# EAGLE design tes1 (EAGLE 6.6.0)
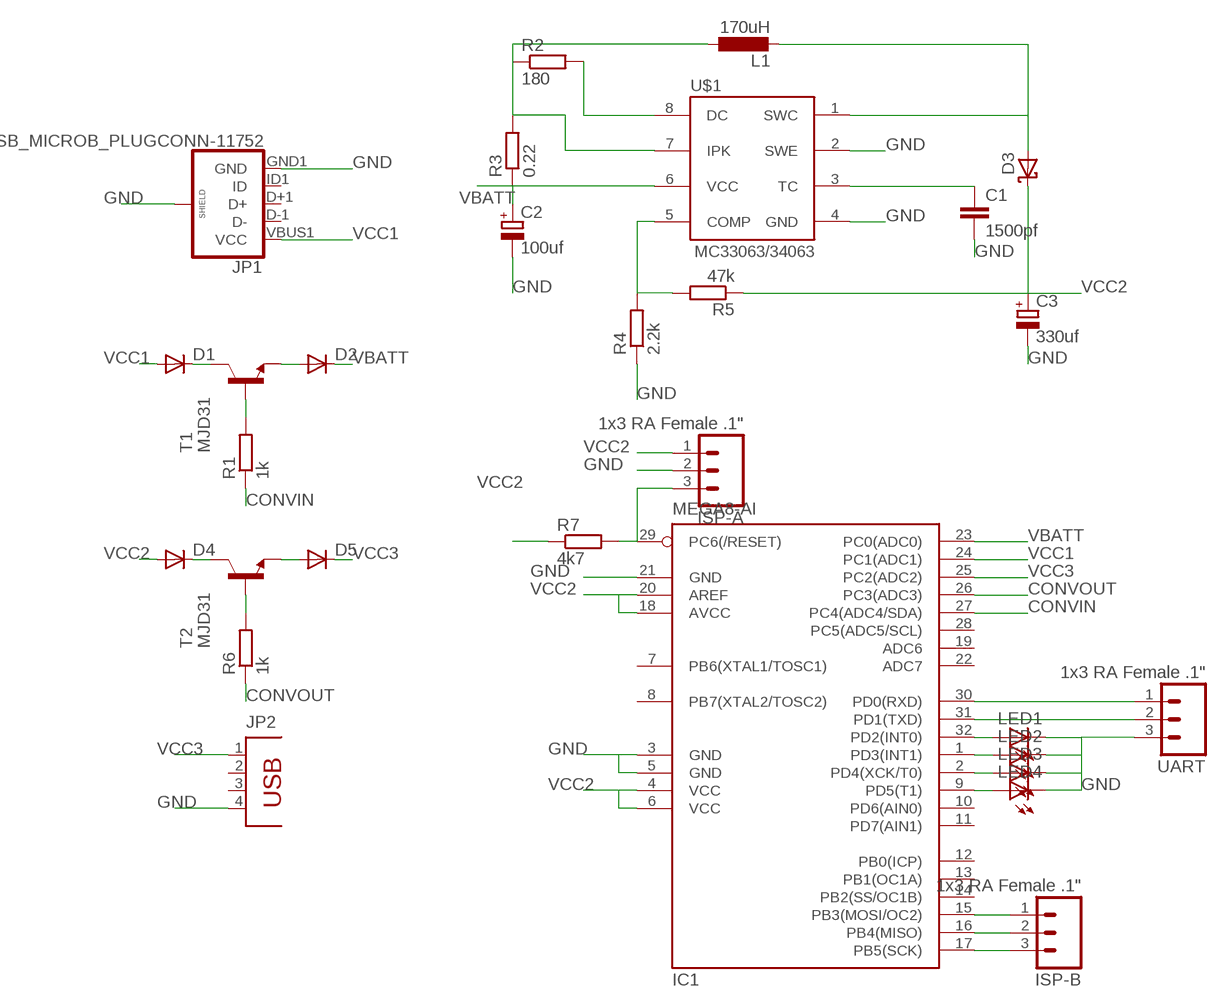
[diagram p0: schematic, sheet 1]

## Parts
C1  1500pf  C-EUC1206  [C1206]
C2  100uf  CPOL-EU153CLV-1014  [153CLV-1014]
C3  330uf  CPOL-EU153CLV-1014  [153CLV-1014]
D1  DIODE-SMC  [SMC]
D2  DIODE-SMC  [SMC]
D3  SCHOTTKY-DIODEF126Z12  [F126Z12]
D4  DIODE-SMC  [SMC]
D5  DIODE-SMC  [SMC]
IC1  MEGA8-AI  [TQFP32-08]
ISP-A  1x3 RA Female .1"  M03SMD_RA_FEMALE  [1X03_SMD_RA_FEMALE]
ISP-B  1x3 RA Female .1"  M03SMD_RA_FEMALE  [1X03_SMD_RA_FEMALE]
JP1  USB_MICROB_PLUGCONN-11752  [USB-B-MICRO-SMD_V03]
JP2  PN87520  [PN87520]
L1  170uH  L-EUL5650M  [L5650M]
LED1  LEDSML1206  [SML1206]
LED2  LEDSML1206  [SML1206]
LED3  LEDSML1206  [SML1206]
LED4  LEDSML1206  [SML1206]
R1  1k  R-EU_R1206  [R1206]
R2  180  R-EU_R1206  [R1206]
R3  0.22  R-EU_R1206  [R1206]
R4  2.2k  R-EU_R1206  [R1206]
R5  47k  R-EU_R1206  [R1206]
R6  1k  R-EU_R1206  [R1206]
R7  4k7  R-EU_R1206  [R1206]
T1  MJD31  [DPAK]
T2  MJD31  [DPAK]
U$1  MC33063/MC34063D  [SO08]
UART  1x3 RA Female .1"  M03SMD_RA_FEMALE  [1X03_SMD_RA_FEMALE]

## Nets
CONVIN: IC1.27(PC4(ADC4/SDA)) R1.1
CONVOUT: IC1.26(PC3(ADC3)) R6.1
GND: C1.2 C2.- C3.- IC1.3(GND) IC1.5(GND) IC1.21(GND) ISP-A.2 JP1.GND1(GND) JP1.SHIELD1(SHIELD) JP1.SHIELD2(SHIELD) JP1.SHIELD3(SHIELD) JP2.4 LED1.C LED2.C LED3.C LED4.C R4.1 U$1.2(SWE) U$1.4(GND) UART.3
N$1: D1.C T1.4(C)
N$2: C1.1 U$1.3(TC)
N$3: D2.A T1.3(E)
N$4: L1.1 R2.1 R3.2 U$1.7(IPK)
N$5: R1.2 T1.1(B)
N$6: R2.2 U$1.8(DC)
N$7: R4.2 R5.2 U$1.5(COMP)
N$8: D4.C T2.4(C)
N$9: D3.A L1.2 U$1.1(SWC)
N$10: D5.A T2.3(E)
N$11: R6.2 T2.1(B)
N$12: IC1.29(PC6(/RESET)) ISP-A.3 R7.2
N$13: IC1.17(PB5(SCK)) ISP-B.3
N$14: IC1.16(PB4(MISO)) ISP-B.2
N$15: IC1.15(PB3(MOSI/OC2)) ISP-B.1
N$16: IC1.9(PD5(T1)) LED4.A
N$17: IC1.2(PD4(XCK/T0)) LED3.A
N$18: IC1.1(PD3(INT1)) LED2.A
N$19: IC1.32(PD2(INT0)) LED1.A
N$20: IC1.31(PD1(TXD)) UART.2
N$21: IC1.30(PD0(RXD)) UART.1
VBATT: C2.+ D2.C IC1.23(PC0(ADC0)) R3.1 U$1.6(VCC)
VCC1: D1.A IC1.24(PC1(ADC1)) JP1.VBUS1(VCC)
VCC2: C3.+ D3.C D4.A IC1.4(VCC) IC1.6(VCC) IC1.18(AVCC) IC1.20(AREF) ISP-A.1 R5.1 R7.1
VCC3: D5.C IC1.25(PC2(ADC2)) JP2.1
Unconnected: IC1.7(PB6(XTAL1/TOSC1)) IC1.8(PB7(XTAL2/TOSC2)) IC1.10(PD6(AIN0)) IC1.11(PD7(AIN1)) IC1.12(PB0(ICP)) IC1.13(PB1(OC1A)) IC1.14(PB2(SS/OC1B)) IC1.19(ADC6) IC1.22(ADC7) IC1.28(PC5(ADC5/SCL)) JP1.D+1(D+) JP1.D-1(D-) JP1.ID1(ID) JP2.2 JP2.3

## Library data of the parts
C1 = resistor:C-EU: CAPACITOR, European symbol
C2 C3 = resistor:CPOL-EU: POLARIZED CAPACITOR, European symbol
D1 D2 D4 D5 = diode:DIODE-: DIODE
D3 = adafruit:SCHOTTKY-DIODE: Schottky Diode
IC1 = atmel:MEGA8: MICROCONTROLLER 8 Kbytes FLASH, 1 kbytes SRAM, 512 bytes EEPROM, USART, 6-channel 10 bit ADC, 2-channel 8 bit ADC Pin compatible with Atmega48, ATMega88, ATMega168 Source: avr.lbr; MPN: ATMEGA8-16AU; OC_FARNELL: 9171371; OC_NEWARK: 73M8863
ISP-A ISP-B UART = SparkFun-Connectors:M03: Header 3 Standard 3-pin 0.1" header. Use with straight break away headers (SKU : PRT-00116), right angle break away headers (PRT-00553), swiss pins (PRT-00743), machine pins (PRT-00117), and female headers (PRT-00115). Molex polarized connector foot print use with SKU : PRT-08232 with associated crimp pins and housings.; PROD_ID: CONN-10926
JP1 = SparkFun-Connectors:USB_MICROB_PLUG: USB Micro-B connectors Some male, some female. Watch your step!; PROD_ID: CONN-11752
JP2 = con-berg:PN87520: BERG USB connector; OC_FARNELL: unknown; OC_NEWARK: unknown
L1 = rcl:L-EU: INDUCTOR, European symbol
LED1-LED4 = led:LED: LED OSRAM: - CHIPLED LG R971, LG N971, LY N971, LG Q971, LY Q971, LO R971, LY R971 LH N974, LH R974 LS Q976, LO Q976, LY Q976 LO Q996 - Hyper CHIPLED LW Q18S LB Q993, LB Q99A, LB R99A - SideLED LS A670, LO A670, LY A670, LG A670, LP A670 LB A673, LV A673, LT A673, LW A673 LH A674 LY A675 LS A676, LA A676, LO A676, LY A676, LW A676 LS A679, LY A679, LG A679 - Hyper Micro SIDELED® LS Y876, LA Y876, LO Y876, LY Y876 LT Y87S - SmartLED LW L88C, LW L88S LB L89C, LB L89S, LG L890 LS L89K, LO L89K, LY L89K LS L896, LA L896, LO L896, LY L896 - TOPLED LS T670, LO T670, LY T670, LG T670, LP T670 LSG T670, LSP T670, LSY T670, LOP T670, LYG T670 LG T671, LOG T671, LSG T671 LB T673, LV T673, LT T673, LW T673 LH T674 LS T676, LA T676, LO T676, LY T676, LB T676, LH T676, LSB T676, LW T676 LB T67C, LV T67C, LT T67C, LS T67K, LO T67K, LY T67K, LW E67C LS E67B, LA E67B, LO E67B, LY E67B, LB E67C, LV E67C, LT E67C LW T67C LS T679, LY T679, LG T679 LS T770, LO T770, LY T770, LG T770, LP T770 LB T773, LV T773, LT T773, LW T773 LH T774 LS E675, LA E675, LY E675, LS T675 LS T776, LA T776, LO T776, LY T776, LB T776 LHGB T686 LT T68C, LB T68C - Hyper Mini TOPLED® LB M676 - Mini TOPLED Santana® LG M470 LS M47K, LO M47K, LY M47K Source: http://www.osram.convergy.de LUXEON: - LUMILED® LXK2-PW12-R00, LXK2-PW12-S00, LXK2-PW14-U00, LXK2-PW14-V00 LXK2-PM12-R00, LXK2-PM12-S00, LXK2-PM14-U00 LXK2-PE12-Q00, LXK2-PE12-R00, LXK2-PE12-S00, LXK2-PE14-T00, LXK2-PE14-U00 LXK2-PB12-K00, LXK2-PB12-L00, LXK2-PB12-M00, LXK2-PB14-N00, LXK2-PB14-P00, LXK2-PB14-Q00 LXK2-PR12-L00, LXK2-PR12-M00, LXK2-PR14-Q00, LXK2-PR14-R00 LXK2-PD12-Q00, LXK2-PD12-R00, LXK2-PD12-S00 LXK2-PH12-R00, LXK2-PH12-S00 LXK2-PL12-P00, LXK2-PL12-Q00, LXK2-PL12-R00 Source: www.luxeon.com KINGBRIGHT: KA-3528ASYC Source: www.kingbright.com
R1 R6 R7 = rcl:R-EU_: RESISTOR, European symbol
R2-R5 = resistor:R-EU_: RESISTOR, European symbol
T1 T2 = transistor-neu-to92:MJD31*: Complementary Power Transistors
U$1 = adafruit:MC33063/MC34063: MC33063 and MC34063 Basic DC/DC converter with internal power-NPN transistor, 100KHz, 1.5A peak switch current. 3-40 input/output.

## Board
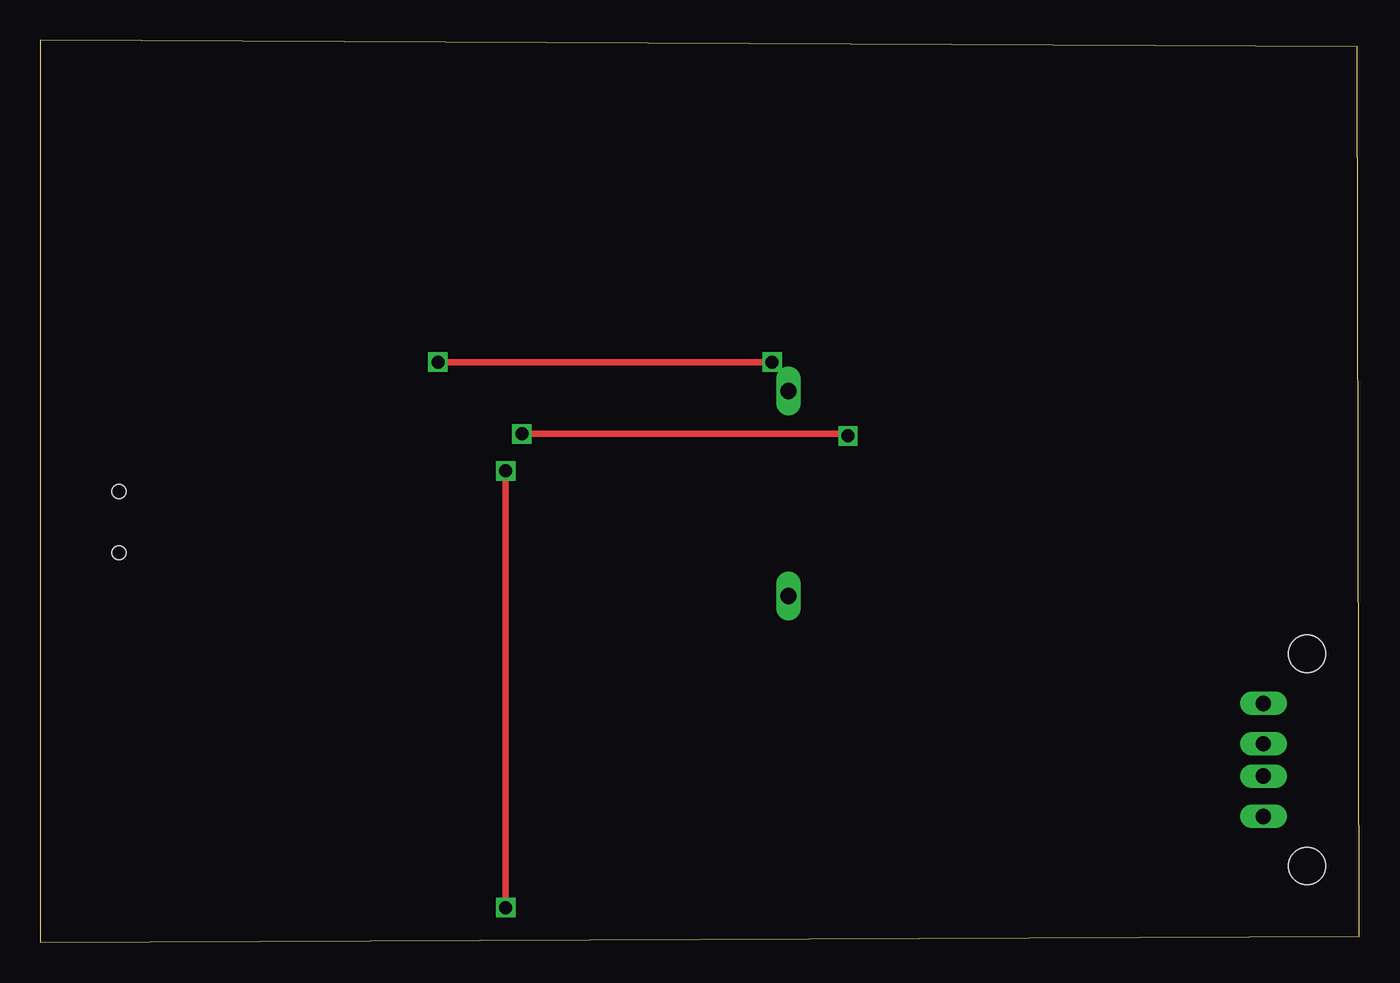
[diagram p1: board, top side]
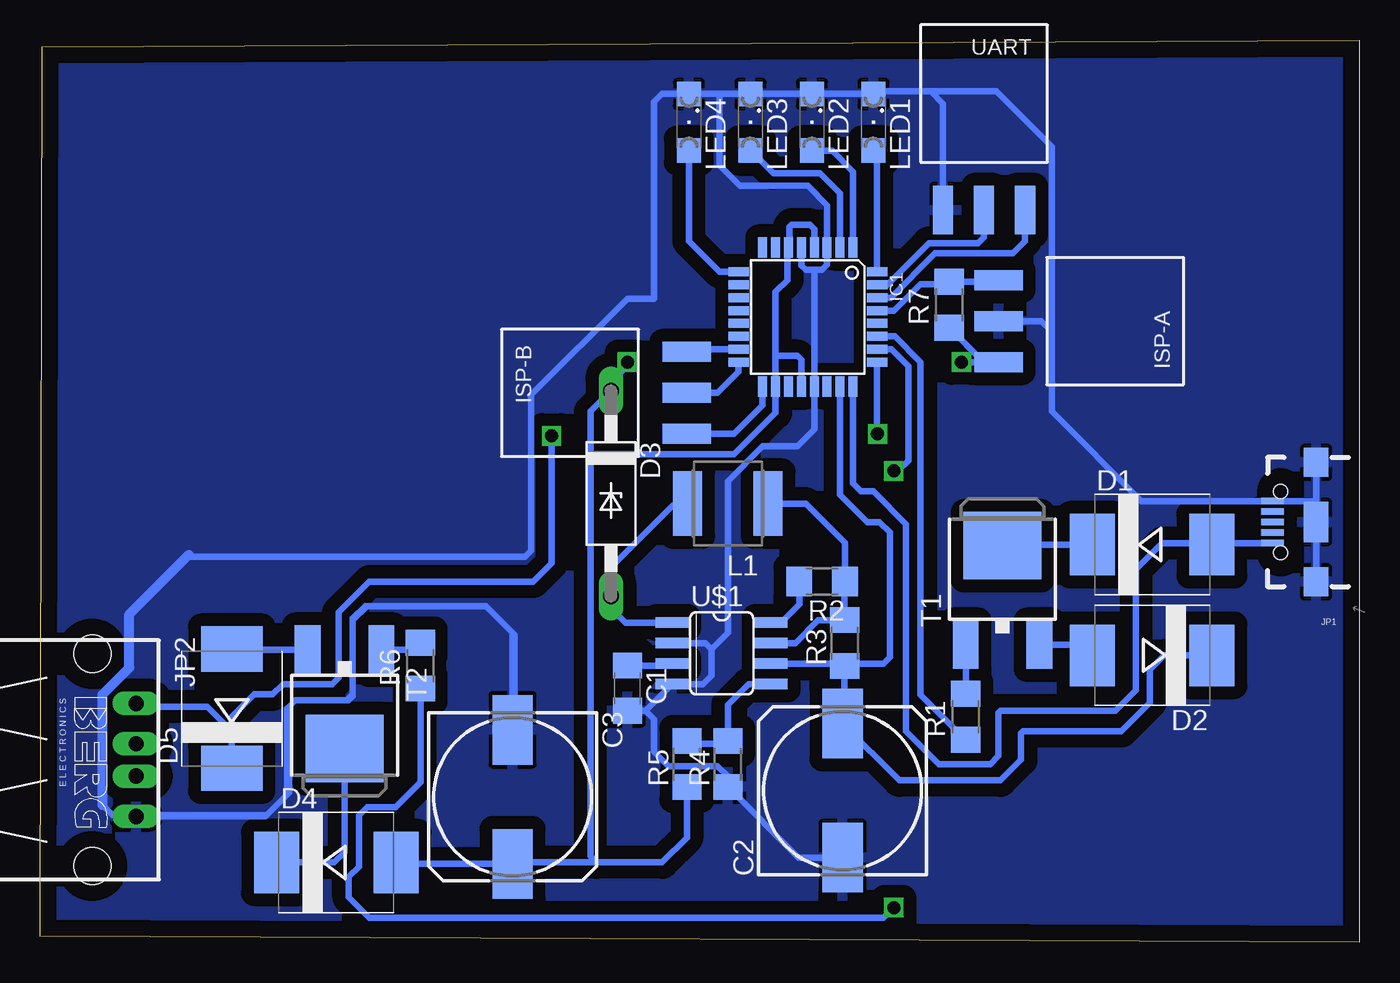
[diagram p2: board, bottom side, seen from below]

Size 81.71 x 55.87 mm. Coordinates in mm from the lower left corner, seen from the top.
Outline: 0,0 81.71,0.38 81.58,55.49 0,55.87 0,0
Copper layers (1*16): Top 0.035mm / dielectric 1.5mm / Bottom 0.035mm
Design rules "default": minimum track width 10mil, minimum drill 24mil, track to track 8mil, track to pad 8mil, pad to pad 8mil, via to via 8mil, smd to smd 8mil, copper to edge 40mil, drill to drill 8mil, minimum pad ring 10mil, minimum via ring 8mil, stop-mask expansion 4mil, vias tented up to drill 0mil, thermal gap 10mil

### Footprints (pad centres in the part's own frame; a part is rotated, then mirrored left to right if it is on the bottom)
C1206 = smd 1.6 x 1.8: 1 -1.4,0; 2 1.4,0
153CLV-1014 = smd 4.3 x 2.5: + 4.15,0; - -4.15,0
SMC = smd 2.8 x 3.8: A 3.7,0; C -3.7,0
F126Z12 = drill 1.016 long: A 6.35,0; C -6.35,0
TQFP32-08 = smd 1.27 x 0.559: 1 -4.293,2.8; 2 -4.293,2; 3 -4.293,1.2; 4 -4.293,0.4; 5 -4.293,-0.4; 6 -4.293,-1.2; 7 -4.293,-2; 8 -4.293,-2.8; 17 4.293,-2.8; 18 4.293,-2; 19 4.293,-1.2; 20 4.293,-0.4; 21 4.293,0.4; 22 4.293,1.2; 23 4.293,2; 24 4.293,2.8 | smd 0.559 x 1.27: 9 -2.8,-4.293; 10 -2,-4.293; 11 -1.2,-4.293; 12 -0.4,-4.293; 13 0.4,-4.293; 14 1.2,-4.293; 15 2,-4.293; 16 2.8,-4.293; 25 2.8,4.293; 26 2,4.293; 27 1.2,4.293; 28 0.4,4.293; 29 -0.4,4.293; 30 -1.2,4.293; 31 -2,4.293; 32 -2.8,4.293
1X03_SMD_RA_FEMALE = smd 1.25 x 3: 1 -2.54,7.225; 2 0,7.225; 3 2.54,7.225
USB-B-MICRO-SMD_V03 = smd 1.4 x 0.4: D+1 2.7,0; D-1 2.7,0.65; GND1 2.7,-1.3; ID1 2.7,-0.65; VBUS1 2.7,1.3 | smd 1.5 x 1.8: SHIELD1 0,3.7; SHIELD2 0,-3.7 | smd 1.5 x 2.5: SHIELD3 0,0 | hole 0.85: 2.2,1.9; 2.2,-1.9
PN87520 = drill 0.95 long: 1 -3.5,2.71; 2 -1,2.71; 3 1,2.71; 4 3.5,2.71 | hole 2.3: -6.57,0; 6.57,0
L5650M = smd 1.8 x 4: 1 -2.5,0; 2 2.5,0
SML1206 = smd 1.5 x 1.5: A 1.75,0; C -1.75,0
R1206 = smd 1.6 x 1.803: 1 -1.422,0; 2 1.422,0
DPAK = smd 1.6 x 3: 1 -2.28,-4.04; 3 2.28,-4.04 | smd 4.826 x 4.191: 4 0,2.096
SO08 = smd 0.66 x 2.032: 1 -1.905,-3.073; 2 -0.635,-3.073; 3 0.635,-3.073; 4 1.905,-3.073; 5 1.905,3.073; 6 0.635,3.073; 7 -0.635,3.073; 8 -1.905,3.073

### Placement (x,y rotation side)
C1  45.34,15.75 270 bottom
C2  32,9.4 90 bottom
C3  52.45,9.02 270 bottom
D1  12.83,24.64 0 bottom
D2  12.83,17.78 180 bottom
D3  46.36,27.81 270 bottom
D4  63.37,4.95 0 bottom
D5  69.85,14.48 90 bottom
IC1  34.16,38.73 270 bottom
ISP-A  15.11,38.48 90 bottom
ISP-B  48.9,34.04 270 bottom
JP1  2.67,26.04 180 bottom
JP2  78.49,11.3 270 bottom
L1  39.12,27.18 180 bottom
LED1  30.1,50.8 270 bottom
LED2  33.91,50.8 270 bottom
LED3  37.72,50.8 270 bottom
LED4  41.53,50.8 270 bottom
R1  24.38,13.97 90 bottom
R2  33.27,22.35 180 bottom
R3  31.88,18.54 90 bottom
R4  39.12,11.05 90 bottom
R5  41.66,11.05 90 bottom
R6  58.17,17.14 90 bottom
R7  25.4,39.5 90 bottom
T1  22.1,22.48 0 bottom
T2  62.87,14.1 180 bottom
U$1  39.5,17.91 270 bottom
UART  23.24,52.58 180 bottom

### Tracks (layer width: path | path; a pad name or v marks a point on that pad's centre or on a via)
CONVIN
  Bottom 0.406: IC1.27 28.77,37.53 27.18,35.94 27.18,15.34 R1.1
CONVOUT  (via drill 0.8)
  Top 0.406: v28.83,29.21 v28.83,2.16
  Bottom 0.406: IC1.26 28.99,36.73 27.94,35.69 27.94,29.85 28.58,29.21 v28.83,29.21 | v28.83,2.16 29.46,1.52 61.34,1.52 62.61,2.79 62.61,4.06 61.98,4.7 61.98,7.87 61.47,8.38 59.69,8.38 58.17,9.91 R6.1
GND
  Bottom 0.406: JP1.SHIELD1 JP1.SHIELD3 2.67,27.34 | 2.67,27.34 JP1.SHIELD2 | 2.67,27.34 JP1.GND1 13.49,27.34 19.05,32.89 19.05,37.85 | C1.2 44.22,14.35 | 44.22,14.35 U$1.4 40.64,16 40.13,16.51 40.13,18.16 | 40.13,18.16 40.51,18.54 U$1.2 | C2.- 34.74,5.25 R4.1 39.12,10.29 39.75,10.92 42.8,10.92 43.69,11.81 43.69,13.81 44.22,14.35 | 39.5,52.55 LED3.C LED2.C LED1.C 29.94,52.7 26.54,52.7 | 39.5,52.55 LED4.C 41.56,52.58 43.18,52.58 43.69,52.07 43.69,39.88 45.34,39.88 51.31,33.91 51.31,24.26 51.69,23.88 72.64,23.88 | 33.91,41.66 33.27,41.66 32.96,41.97 IC1.3 32.96,45.66 34.16,46.86 38.35,46.86 39.62,48.13 39.62,52.42 39.5,52.55 | 33.91,41.66 34.29,41.66 34.54,41.91 34.54,43.01 IC1.5 | 33.91,41.66 33.76,41.51 IC1.21 33.76,31.77 34.8,30.73 36.96,30.73 39.12,28.57 39.12,19.18 40.13,18.16 | ISP-A.2 19.69,38.48 19.05,37.85 | 19.05,37.85 19.05,49.28 22.48,52.7 26.54,52.7 | UART.3 25.78,51.94 26.54,52.7 | JP2.4 67.76,7.8 67.69,7.87 | 67.69,7.87 66.42,9.14 | 66.42,9.14 66.42,14.48 66.29,14.61 | 62.74,14.99 62.61,14.99 62.36,15.24 62.36,19.94 61.47,20.83 | 61.47,20.83 54.1,20.83 52.45,19.18 | 52.45,19.18 52.32,19.05 52.32,13.29 C3.- 52.45,19.18 | 61.47,20.83 61.59,20.83 62.36,20.07 62.36,15.37 62.74,14.99 | 62.74,14.99 65.91,14.99 66.29,14.61 | 66.29,14.61 66.29,9.27 66.42,9.14 | 67.69,7.87 77.22,7.87 77.85,8.51
  Bottom 0.61: 77.85,8.51 77.85,15.37 76.2,17.02 76.2,20.32 72.52,24
  pour Bottom (isolate 0.813): 0.64,55.12 81.03,55.12 81.03,0 0.64,0
N$1
  Bottom 0.406: D1.C 21.46,24.64 21.46,24.38 22.1,24.38 T1.4
N$2
  Bottom 0.406: C1.1 42.69,17.15 U$1.3
N$3
  Bottom 0.406: T1.3 16.53,18.44 D2.A
N$4
  Bottom 0.406: U$1.7 34.93,18.54 33.53,19.94 31.9,19.94 R3.2 31.88,22.33 R2.1 31.85,24.74 34.29,27.18 L1.1
N$5
  Bottom 0.406: R1.2 T1.1
N$6
  Bottom 0.406: U$1.8 35.81,19.81 34.67,20.96 34.67,21.59 34.54,21.72 34.54,22.2 R2.2
N$7
  Bottom 0.406: R5.2 41.5,12.32 38.99,12.32 39.12,12.45 R4.2 39.12,14.73 37.85,16 U$1.5
N$8
  Bottom 0.406: D4.C 63.5,4.95 62.87,5.59 T2.4
N$9
  Bottom 0.406: U$1.1 45.47,19.81 46.36,20.7 D3.A 46.36,23.24 42.55,27.05 41.74,27.05 L1.2
N$10
  Bottom 0.406: T2.3 69.81,18.14 D5.A
N$11
  Bottom 0.406: T2.1 58.6,18.14 R6.2
N$12
  Bottom 0.406: ISP-A.3 22.44,40.92 R7.2 25.55,40.77 27.18,40.77 28.81,39.13 IC1.29
N$13
  Bottom 0.406: IC1.17 36.96,33.27 38.73,31.5 ISP-B.3
N$14
  Bottom 0.406: IC1.16 38.46,35.33 39.75,34.04 ISP-B.2
N$15
  Bottom 0.406: IC1.15 41.51,36.73 ISP-B.1
N$16
  Bottom 0.406: IC1.9 39.63,41.53 41.53,43.43 LED4.A
N$17
  Bottom 0.406: IC1.2 32.16,46.39 33.4,47.62 36.29,47.62 LED3.A
N$18
  Bottom 0.406: IC1.1 31.36,47.75 32.64,49.02 33.88,49.02 LED2.A
N$19
  Bottom 0.406: IC1.32 29.87,48.82 LED1.A
N$20
  Bottom 0.406: IC1.31 29.24,40.73 26.67,43.31 23.62,43.31 23.24,43.69 UART.2
N$21
  Bottom 0.406: IC1.30 29.03,39.93 26.29,42.67 21.46,42.67 20.7,43.43 UART.1
VBATT
  Bottom 0.406: R3.1 31.88,13.55 C2.+ 28.49,10.03 22.23,10.03 20.95,11.3 20.95,12.95 20.83,13.08 14.73,13.08 12.95,14.86 12.95,16.89 12.06,17.78 D2.C | U$1.6 31.88,17.27 R3.1 | IC1.23 32.16,27.72 30.48,26.04 29.72,26.04 29.08,25.4 29.08,17.65 29.46,17.27 31.73,17.27 R3.1
VCC1
  Bottom 0.406: JP1.VBUS1 9.13,24.73 | 9.13,24.73 D1.A | 9.13,24.73 12.22,24.73 13.84,23.11 13.84,15.62 15.11,14.35 22.23,14.35 22.35,14.22 22.35,11.56 22.86,11.05 26.03,11.05 28.07,13.08 28.07,25.91 30.1,27.94 30.86,27.94 31.37,28.45 31.36,28.45 IC1.24
VCC2  (via drill 0.8)
  Top 0.406: v24.64,35.94 v45.34,35.94
  Bottom 0.406: D4.A 59.93,4.7 60.2,4.7 60.03,4.87 C3.+ 52.37,4.95 47.24,4.95 | R5.1 41.66,6.48 43.18,4.95 47.24,4.95 | ISP-A.1 23.24,35.94 | 23.24,35.94 23.27,35.94 | 23.27,35.94 R7.1 25.38,38.07 23.24,35.94 | IC1.4 33.76,44.18 34.04,44.45 35.18,44.45 35.31,44.32 35.31,43.08 IC1.6 35.43,42.96 35.43,41.02 36.16,40.29 36.16,36.32 | 36.16,36.32 IC1.18 36.16,32.8 38.73,30.23 47.5,30.23 47.62,30.1 | IC1.20 34.56,36.09 34.8,36.32 36.16,36.32 | 47.62,30.1 47.62,5.33 47.24,4.95 | 47.62,30.1 47.62,32.89 D3.C 45.85,34.67 45.85,35.18 45.34,35.69 v45.34,35.94 | 23.27,35.94 v24.64,35.94
VCC3  (via drill 0.8)
  Top 0.406: v29.84,31.5 49.91,31.5 v50.04,31.37
  Bottom 0.406: JP2.1 75.58,14.61 71.37,14.61 69.85,13.08 D5.C 69.85,13.97 68.45,15.37 67.31,15.37 66.67,16 63.63,16 63.25,16.38 63.25,20.45 61.34,22.35 51.18,22.35 50.04,23.5 v50.04,31.37 | IC1.25 29.87,31.52 v29.84,31.5